# Altium schematic sheet RF_AFE.SchDoc: RFSoC_AMC
size 420 x 297 mm; Author: T. Przywozki; CompanyName: WUT ISE; DrawnBy: T. Przywozki; Organization: WUT ISE; Address1: PW ISE; Address2: Nowowiejska 15/19 00-665 Warsaw; Revision: 1.0; SheetNumber: 18; ModifiedBy: -; CheckedDate: -; Title2: 8 channel ADC & DAC; DivGrp: WUT ISE; Designer: T. Przywozki
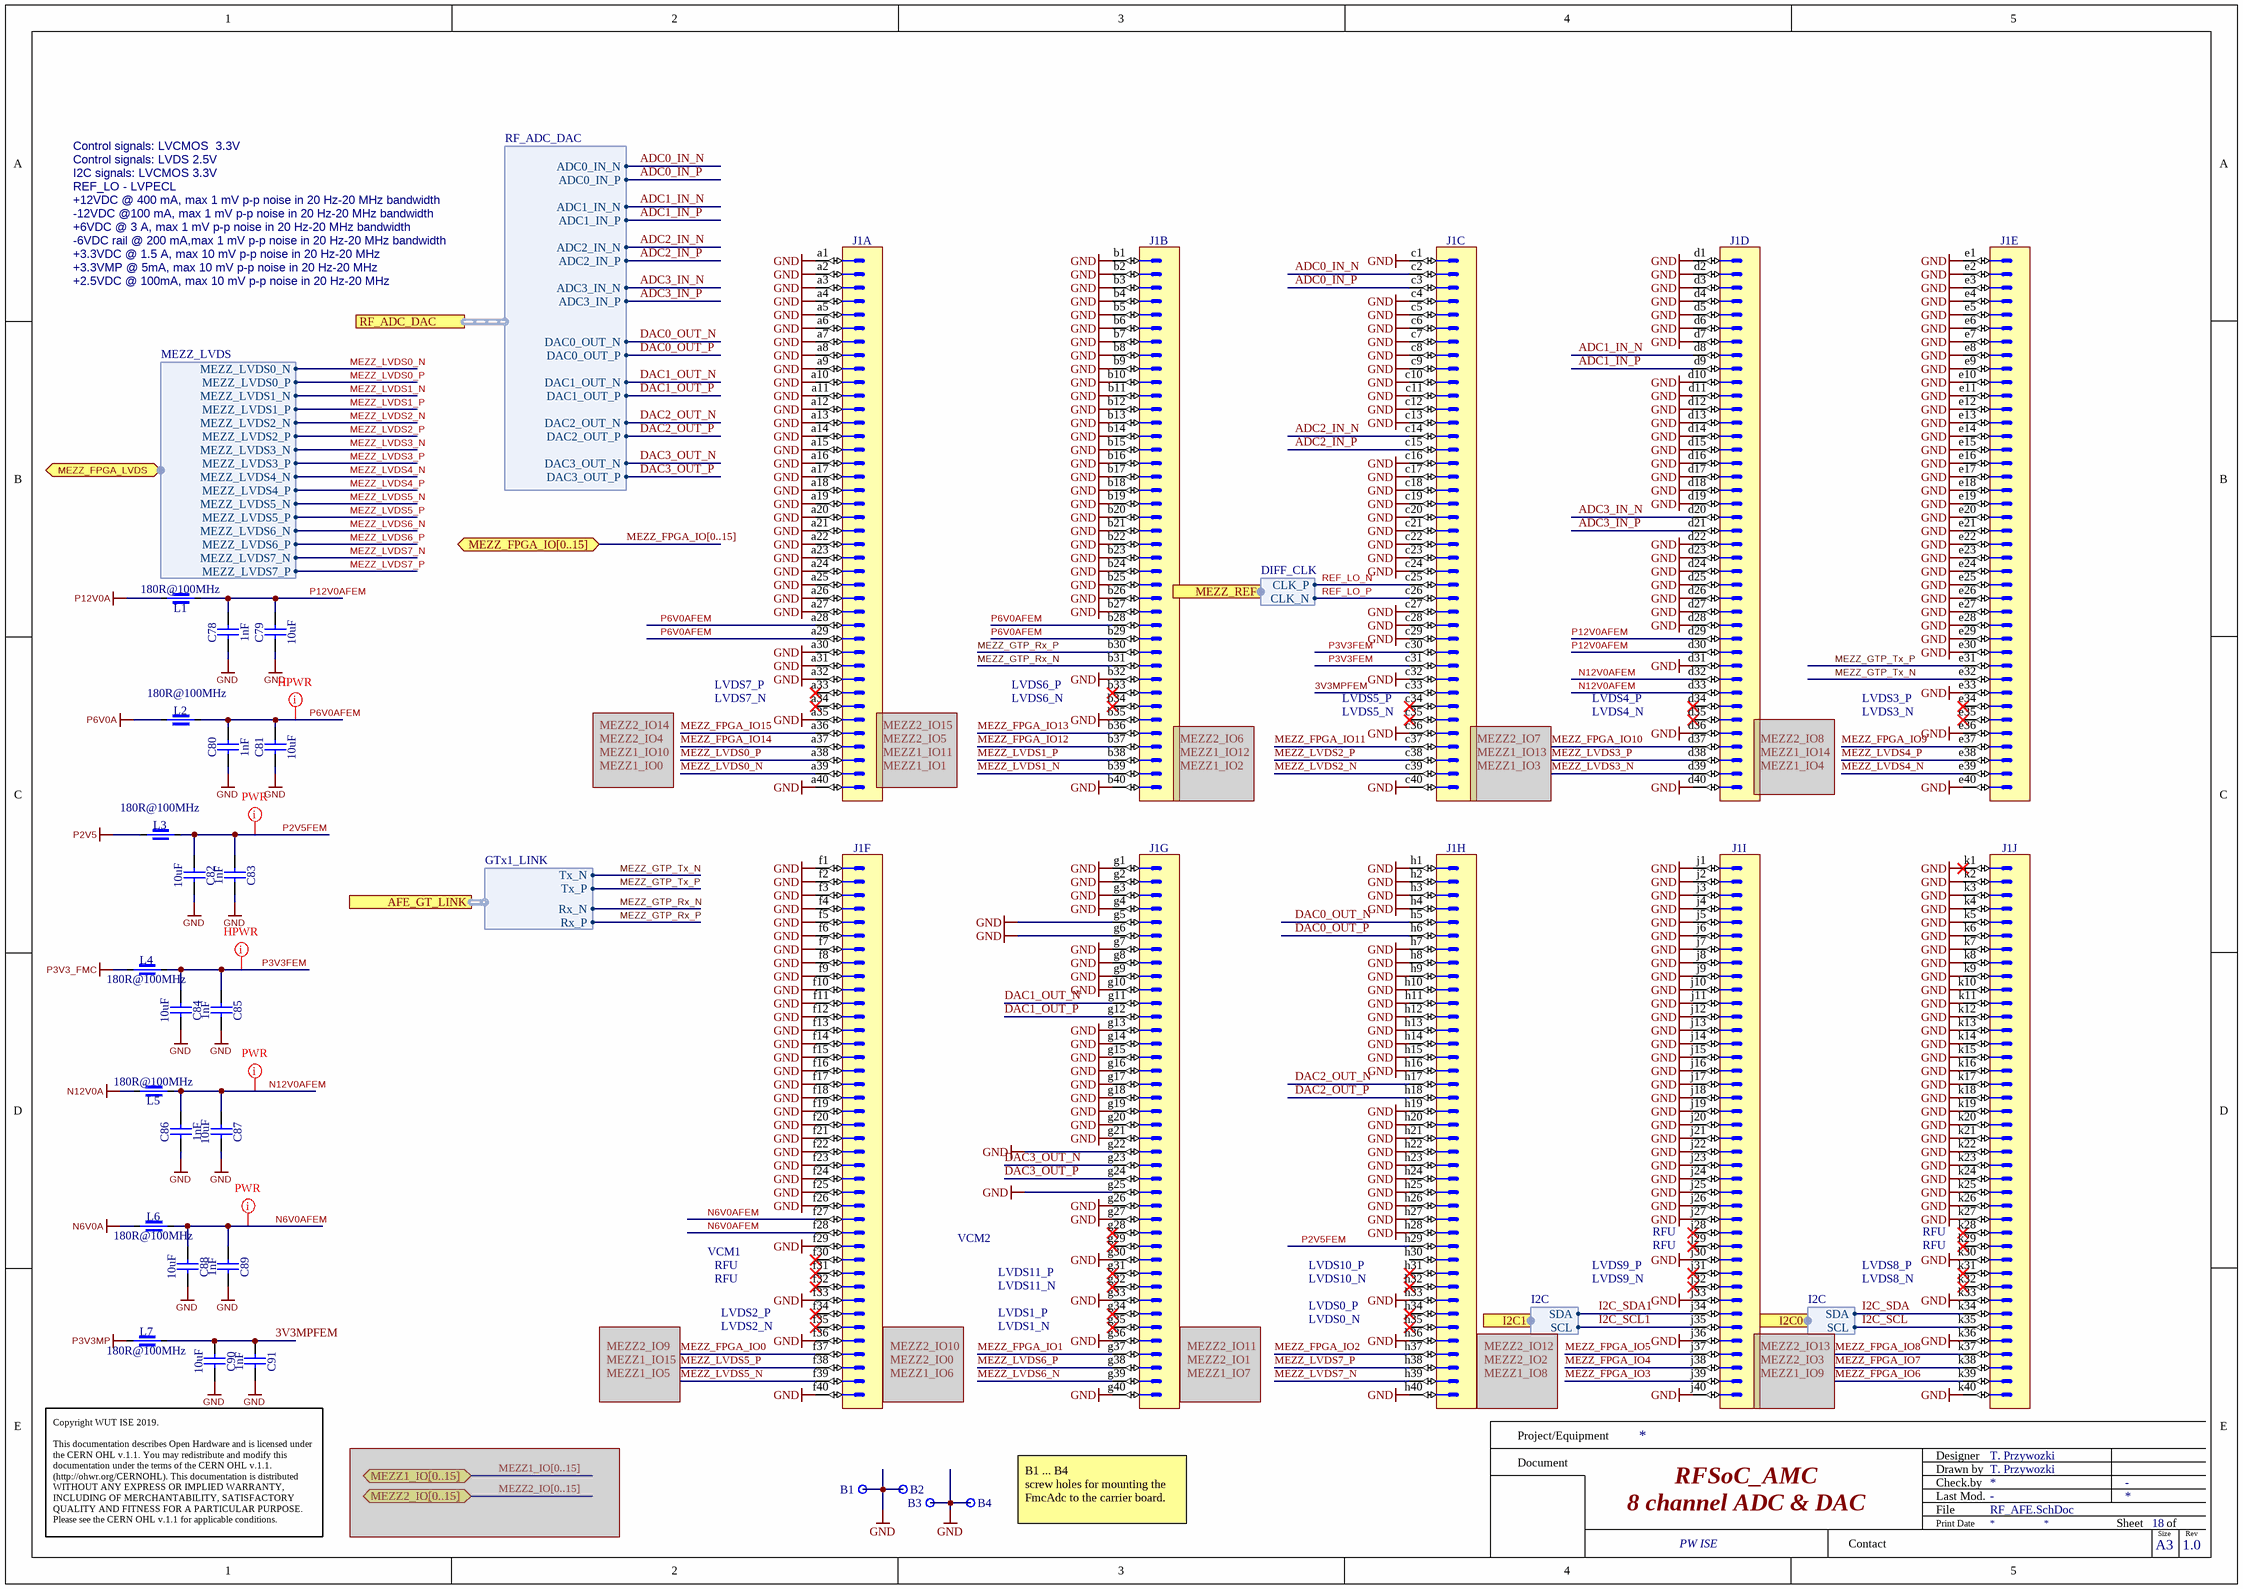
[diagram p0: RF_AFE.SchDoc]

## Parts
B1  Plated Hole  [MTG270_500]  (value not drawn)
B2  Plated Hole  [MTG270_500]  (value not drawn)
B3  Plated Hole  [MTG270_500]  (value not drawn)
B4  Plated Hole  [MTG270_500]  (value not drawn)
C78  1nF  [CAPC1608X90N]
C79  10uF  [CAPC3216X180N]
C80  1nF  [CAPC1608X90N]
C81  10uF  [CAPC3216X180N]
C82  10uF  [CAPC3216X180N]
C83  1nF  [CAPC1608X90N]
C84  10uF  [CAPC3216X180N]
C85  1nF  [CAPC1608X90N]
C86  1nF  [CAPC1608X90N]
C87  10uF  [CAPC3216X180N]
C88  10uF  [CAPC3216X180N]
C89  1nF  [CAPC1608X90N]
C90  10uF  [CAPC3216X180N]
C91  1nF  [CAPC1608X90N]
J1  VITA 57  [SAMTEC_ASP-134488-01]  (value not drawn)  (parts A,B,C,D,E,F,G,H,I,J of 10)
L1  180R@100MHz  [INDC4516X180N]
L2  180R@100MHz  [INDC4516X180N]
L3  180R@100MHz  [INDC4516X180N]
L4  180R@100MHz  [INDC4516X180N]
L5  180R@100MHz  [INDC4516X180N]
L6  180R@100MHz  [INDC4516X180N]
L7  180R@100MHz  [INDC4516X180N]

## Ports
AFE_GT_LINK (harness GTx1_LINK), I2C0 (harness I2C), I2C1 (harness I2C), MEZZ1_IO[0..15] (bidir), MEZZ2_IO[0..15] (bidir), MEZZ_FPGA_IO[0..15] (bidir), MEZZ_FPGA_LVDS (bidir, harness MEZZ_LVDS), MEZZ_REF (harness DIFF_CLK), RF_ADC_DAC (harness RF_ADC_DAC)

## Harnesses
RF_ADC_DAC: ADC0_IN_N, ADC0_IN_P, ADC1_IN_N, ADC1_IN_P, ADC2_IN_N, ADC2_IN_P, ADC3_IN_N, ADC3_IN_P, DAC0_OUT_N, DAC0_OUT_P, DAC1_OUT_N, DAC1_OUT_P, DAC2_OUT_N, DAC2_OUT_P, DAC3_OUT_N, DAC3_OUT_P
I2C: SCL, SDA
MEZZ_LVDS: MEZZ_LVDS0_N, MEZZ_LVDS0_P, MEZZ_LVDS1_N, MEZZ_LVDS1_P, MEZZ_LVDS2_N, MEZZ_LVDS2_P, MEZZ_LVDS3_N, MEZZ_LVDS3_P, MEZZ_LVDS4_N, MEZZ_LVDS4_P, MEZZ_LVDS5_N, MEZZ_LVDS5_P, MEZZ_LVDS6_N, MEZZ_LVDS6_P, MEZZ_LVDS7_N, MEZZ_LVDS7_P
GTx1_LINK: Rx_P, Rx_N, Tx_P, Tx_N
DIFF_CLK: CLK_P, CLK_N

## Nets
GND: B1.1 B2.1 B3.1 B4.1 C78.2 C79.2 C80.1 C81.1 C82.1 C83.1 C84.1 C85.1 C86.1 C87.2 C88.1 C89.1 C90.1 C91.1 J1.a1 J1.a2 J1.a3 J1.a4 J1.a5 J1.a6 J1.a7 J1.a8 J1.a9 J1.a10 J1.a11 J1.a12 J1.a13 J1.a14 J1.a15 J1.a16 J1.a17 J1.a18 J1.a19 J1.a20 J1.a21 J1.a22 J1.a23 J1.a24 J1.a25 J1.a26 J1.a27 J1.a30 J1.a31 J1.a32 J1.a35 J1.a40 J1.b1 J1.b2 J1.b3 J1.b4 J1.b5 J1.b6 J1.b7 J1.b8 J1.b9 J1.b10 J1.b11 J1.b12 J1.b13 J1.b14 J1.b15 J1.b16 J1.b17 J1.b18 J1.b19 J1.b20 J1.b21 J1.b22 J1.b23 J1.b24 J1.b25 J1.b26 J1.b27 J1.b32 J1.b35 J1.b40 J1.c1 J1.c4 J1.c5 J1.c6 J1.c7 J1.c8 J1.c9 J1.c10 J1.c11 J1.c12 J1.c13 J1.c16 J1.c17 J1.c18 J1.c19 J1.c20 J1.c21 J1.c22 J1.c23 J1.c24 J1.c27 J1.c28 J1.c29 J1.c32 J1.c36 J1.c40 J1.d1 J1.d2 J1.d3 J1.d4 J1.d5 J1.d6 J1.d7 J1.d10 J1.d11 J1.d12 J1.d13 J1.d14 J1.d15 J1.d16 J1.d17 J1.d18 J1.d19 J1.d22 J1.d23 J1.d24 J1.d25 J1.d26 J1.d27 J1.d28 J1.d31 J1.d36 J1.d40 J1.e1 J1.e2 J1.e3 J1.e4 J1.e5 J1.e6 J1.e7 J1.e8 J1.e9 J1.e10 J1.e11 J1.e12 J1.e13 J1.e14 J1.e15 J1.e16 J1.e17 J1.e18 J1.e19 J1.e20 J1.e21 J1.e22 J1.e23 J1.e24 J1.e25 J1.e26 J1.e27 J1.e28 J1.e29 J1.e30 J1.e33 J1.e36 J1.e40 J1.f1 J1.f2 J1.f3 J1.f4 J1.f5 J1.f6 J1.f7 J1.f8 J1.f9 J1.f10 J1.f11 J1.f12 J1.f13 J1.f14 J1.f15 J1.f16 J1.f17 J1.f18 J1.f19 J1.f20 J1.f21 J1.f22 J1.f23 J1.f24 J1.f25 J1.f26 J1.f29 J1.f33 J1.f36 J1.f40 J1.g1 J1.g2 J1.g3 J1.g4 J1.g5 J1.g6 J1.g7 J1.g8 J1.g9 J1.g10 J1.g13 J1.g14 J1.g15 J1.g16 J1.g17 J1.g18 J1.g19 J1.g20 J1.g21 J1.g22 J1.g25 J1.g26 J1.g27 J1.g30 J1.g33 J1.g36 J1.g40 J1.h1 J1.h2 J1.h3 J1.h4 J1.h7 J1.h8 J1.h9 J1.h10 J1.h11 J1.h12 J1.h13 J1.h14 J1.h15 J1.h16 J1.h19 J1.h20 J1.h21 J1.h22 J1.h23 J1.h24 J1.h25 J1.h26 J1.h27 J1.h28 J1.h33 J1.h36 J1.h40 J1.j1 J1.j2 J1.j3 J1.j4 J1.j5 J1.j6 J1.j7 J1.j8 J1.j9 J1.j10 J1.j11 J1.j12 J1.j13 J1.j14 J1.j15 J1.j16 J1.j17 J1.j18 J1.j19 J1.j20 J1.j21 J1.j22 J1.j23 J1.j24 J1.j25 J1.j26 J1.j27 J1.j30 J1.j33 J1.j36 J1.j40 J1.k1 J1.k2 J1.k3 J1.k4 J1.k5 J1.k6 J1.k7 J1.k8 J1.k9 J1.k10 J1.k11 J1.k12 J1.k13 J1.k14 J1.k15 J1.k16 J1.k17 J1.k18 J1.k19 J1.k20 J1.k21 J1.k22 J1.k23 J1.k24 J1.k25 J1.k26 J1.k27 J1.k30 J1.k33 J1.k36 J1.k40
N6V0A: L6.2
N12V0A: L5.2
P2V5: L3.2
P3V3_FMC: L4.2
P3V3MP: L7.2
P6V0A: L2.1
P12V0A: L1.1
3V3MPFEM: C90.2 C91.2 J1.c33 L7.1
ADC0_IN_N: J1.c2 ; port RF_ADC_DAC.ADC0_IN_N
ADC0_IN_P: J1.c3 ; port RF_ADC_DAC.ADC0_IN_P
ADC1_IN_N: J1.d8 ; port RF_ADC_DAC.ADC1_IN_N
ADC1_IN_P: J1.d9 ; port RF_ADC_DAC.ADC1_IN_P
ADC2_IN_N: J1.c14 ; port RF_ADC_DAC.ADC2_IN_N
ADC2_IN_P: J1.c15 ; port RF_ADC_DAC.ADC2_IN_P
ADC3_IN_N: J1.d20 ; port RF_ADC_DAC.ADC3_IN_N
ADC3_IN_P: J1.d21 ; port RF_ADC_DAC.ADC3_IN_P
DAC0_OUT_N: J1.h5 ; port RF_ADC_DAC.DAC0_OUT_N
DAC0_OUT_P: J1.h6 ; port RF_ADC_DAC.DAC0_OUT_P
DAC1_OUT_N: J1.g11 ; port RF_ADC_DAC.DAC1_OUT_N
DAC1_OUT_P: J1.g12 ; port RF_ADC_DAC.DAC1_OUT_P
DAC2_OUT_N: J1.h17 ; port RF_ADC_DAC.DAC2_OUT_N
DAC2_OUT_P: J1.h18 ; port RF_ADC_DAC.DAC2_OUT_P
DAC3_OUT_N: J1.g23 ; port RF_ADC_DAC.DAC3_OUT_N
DAC3_OUT_P: J1.g24 ; port RF_ADC_DAC.DAC3_OUT_P
I2C_SCL: J1.k35 ; port I2C0.SCL
I2C_SCL1: J1.j35 ; port I2C1.SCL
I2C_SDA: J1.k34 ; port I2C0.SDA
I2C_SDA1: J1.j34 ; port I2C1.SDA
MEZZ_FPGA_IO1: J1.g37
MEZZ_FPGA_IO2: J1.h37
MEZZ_FPGA_IO3: J1.j39
MEZZ_FPGA_IO4: J1.j38
MEZZ_FPGA_IO5: J1.j37
MEZZ_FPGA_IO9: J1.e37
MEZZ_FPGA_IO11: J1.c37
MEZZ_FPGA_IO12: J1.b37
MEZZ_FPGA_IO13: J1.b36
MEZZ_FPGA_IO14: J1.a37
MEZZ_FPGA_IO15: J1.a36
MEZZ_GTP_Rx_N: J1.b31 ; port AFE_GT_LINK.Rx_N
MEZZ_GTP_Rx_P: J1.b30 ; port AFE_GT_LINK.Rx_P
MEZZ_GTP_Tx_N: J1.e32 ; port AFE_GT_LINK.Tx_N
MEZZ_GTP_Tx_P: J1.e31 ; port AFE_GT_LINK.Tx_P
MEZZ_LVDS0_N: J1.a39 ; port MEZZ_FPGA_LVDS.MEZZ_LVDS0_N
MEZZ_LVDS0_P: J1.a38 ; port MEZZ_FPGA_LVDS.MEZZ_LVDS0_P
MEZZ_LVDS1_N: J1.b39 ; port MEZZ_FPGA_LVDS.MEZZ_LVDS1_N
MEZZ_LVDS1_P: J1.b38 ; port MEZZ_FPGA_LVDS.MEZZ_LVDS1_P
MEZZ_LVDS2_N: J1.c39 ; port MEZZ_FPGA_LVDS.MEZZ_LVDS2_N
MEZZ_LVDS2_P: J1.c38 ; port MEZZ_FPGA_LVDS.MEZZ_LVDS2_P
MEZZ_LVDS3_N: port MEZZ_FPGA_LVDS.MEZZ_LVDS3_N
MEZZ_LVDS3_P: port MEZZ_FPGA_LVDS.MEZZ_LVDS3_P
MEZZ_LVDS4_N: J1.e39 ; port MEZZ_FPGA_LVDS.MEZZ_LVDS4_N
MEZZ_LVDS4_P: J1.e38 ; port MEZZ_FPGA_LVDS.MEZZ_LVDS4_P
MEZZ_LVDS5_N: port MEZZ_FPGA_LVDS.MEZZ_LVDS5_N
MEZZ_LVDS5_P: port MEZZ_FPGA_LVDS.MEZZ_LVDS5_P
MEZZ_LVDS6_N: J1.g39 ; port MEZZ_FPGA_LVDS.MEZZ_LVDS6_N
MEZZ_LVDS6_P: J1.g38 ; port MEZZ_FPGA_LVDS.MEZZ_LVDS6_P
MEZZ_LVDS7_N: J1.h39 ; port MEZZ_FPGA_LVDS.MEZZ_LVDS7_N
MEZZ_LVDS7_P: J1.h38 ; port MEZZ_FPGA_LVDS.MEZZ_LVDS7_P
N6V0AFEM: C88.2 C89.2 J1.f27 J1.f28 L6.1
N12V0AFEM: C86.2 C87.1 J1.d32 J1.d33 L5.1
P2V5FEM: C82.2 C83.2 J1.h29 L3.1
P3V3FEM: C84.2 C85.2 J1.c30 J1.c31 L4.1
P6V0AFEM: C80.2 C81.2 J1.a28 J1.a29 J1.b28 J1.b29 L2.2
P12V0AFEM: C78.1 C79.1 J1.d29 J1.d30 L1.2
REF_LO_N: J1.c25 ; port MEZZ_REF.CLK_P
REF_LO_P: J1.c26 ; port MEZZ_REF.CLK_N

Not connected (* = marked no-connect by the designer): J1 a33* a34* b33* b34* c34* c35* d34* d35* d37 d38 d39 e34* e35* f30* f31* f32* f34* f35* f37 f38 f39 g28* g29* g31* g32* g34* g35* h30 h31* h32* h34* h35* j28* j29* j31* j32* k28* k29* k31* k32* k37 k38 k39

## Buses and harness runs
bus MEZZ_FPGA_IO[0..15] = port MEZZ_FPGA_IO[0..15]

## Layout directives
net class HPWR: P3V3FEM, P6V0AFEM
net class PWR: N6V0AFEM, N12V0AFEM, P2V5FEM

## Notes on the sheet
- I2C signals: LVCMOS 3.3V
- REF_LO - LVPECL
- Control signals: LVCMOS  3.3V
- Control signals: LVDS 2.5V
- +6VDC @ 3 A, max 1 mV p-p noise in 20 Hz-20 MHz bandwidth
- +3.3VMP @ 5mA, max 10 mV p-p noise in 20 Hz-20 MHz
- -12VDC @100 mA, max 1 mV p-p noise in 20 Hz-20 MHz bandwidth
- +3.3VDC @ 1.5 A, max 10 mV p-p noise in 20 Hz-20 MHz
- -6VDC rail @ 200 mA,max 1 mV p-p noise in 20 Hz-20 MHz bandwidth
- +12VDC @ 400 mA, max 1 mV p-p noise in 20 Hz-20 MHz bandwidth
- +2.5VDC @ 100mA, max 10 mV p-p noise in 20 Hz-20 MHz
- LVDS7_P
- LVDS7_N
- LVDS6_P
- LVDS6_N
- (near J1) LVDS5_P
- (near J1) LVDS5_N
- LVDS4_P
- LVDS4_N
- LVDS3_P
- LVDS3_N
- VCM1
- RFU
- VCM2
- LVDS10_P
- LVDS9_P
- (near J1) RFU
- LVDS8_P
- LVDS2_P
- LVDS2_N
- LVDS1_P
- LVDS1_N
- LVDS11_P
- LVDS11_N
- LVDS0_P
- LVDS0_N
- LVDS10_N
- LVDS9_N
- LVDS8_N
- B1 ... B4
  screw holes for mounting the FmcAdc to the carrier board.
- Project/Equipment
- Document
- Designer
- Drawn by
- Check.by
- Copyright WUT ISE 2019.
  This documentation describes Open Hardware and is licensed under the CERN OHL v.1.1. You may redistribute and modify this documentation under the terms of the CERN OHL v.1.1. (http://ohwr.org/CERNOHL). This documentation is distributed WITHOUT ANY EXPRESS OR IMPLIED WARRANTY, INCLUDING OF MERCHANTABILITY, SATISFACTORY QUALITY AND FITNESS FOR A PARTICULAR PURPOSE. Please see the CERN OHL v.1.1 for applicable conditions.
- Contact
- File
- Last Mod.
- Print Date
- Sheet
- Size
- A3
- of
- Rev

## Library data of the parts
B1-B4 = PLATED_HOLE2.7_PAD5.0: Single Terminal Socket; Part Description: Plated Through Hole: Hole Dia.=2.7mm Pad Dia.=5.0mm; Mounted: No; Part Number: PLATED_HOLE2.7_PAD5.0; Component Kind: Standard (No BOM); Component Type: Standard (No BOM); Pin Count: 1; Family: Plated Hole; Socket: No; SMD: No; Sense: No; Status: None; ComponentHeight: 0mm; HelpURL: Undefined; Author: CERN DEM JMW; CreateDate: 27.09.2011; LatestRevisionDate: 27.09.2011; PackageDescription: Plated Through Hole: Hole Dia.=2.7mm Pad Dia.=5.0mm
C78 C80 C83 C85 C86 C89 C91 = CC0603_1NF_50V_5%_NP0: Non-polarised capacitor; Manufacturer: GENERIC; Manufacturer1 Part Number: CC0603JRNPO9BN102; Part Description: SMD Multilayer Chip Ceramic Capacitor; TC: C0G/NP0; Tolerance: ±5%; Voltage: 50V; Case: 0603; Manufacturer Part Number: CC0603_1NF_50V_5%_NP0; Manufacturer1 Example: YAGEO PHYCOMP; Part Number: CC0603_1NF_50V_5%_NP0; Pin Count: 2; SMD: Yes; Status: Preferred; Value: 1nF; Component Kind: Standard; Component Type: Standard; Mounted: Yes; Socket: No; Sense: No; Manufacturer1 ComponentHeight: 0.9mm; HelpURL: \\cern.ch\dfs\Applications\Altium\Datasheets\CC0805_NP0_PHYCOMP_16VTO50V.pdf; Author: CERN DEM JLC; CreateDate: 22.10.2012; LatestRevisionDate: 22.10.2012
C79 C81 C82 C84 C87 C88 C90 = CC1206_10uF_25V_10%_X7R: Non-polarised capacitor; Manufacturer: GENERIC; Manufacturer1 Part Number: C1206C106K4RACTU; Part Description: SMD Multilayer Chip Ceramic Capacitor; TC: X7R; Tolerance: ±10%; Voltage: 25V; Case: 1206; Manufacturer Part Number: CC1206_10uF_25V_10%_X7R; Manufacturer1 Example: KEMET; Part Number: CC1206_10UF_25V_10%_X7R; Pin Count: 2; SMD: Yes; Status: Preferred; Value: 10uF; Component Kind: Standard; Component Type: Standard; Mounted: Yes; Socket: No; Sense: No; Manufacturer1 ComponentHeight: 1.8mm; HelpURL: \\cern.ch\dfs\Applications\Altium\Datasheets\CC1206_X7R_KEMET.pdf; Author: CERN DEM JLC; CreateDate: 12.09.2012; LatestRevisionDate: 12.09.2012
J1 = SAMTEC_ASP-134488-01: Connector VITA 57, 400 Male contacts in 10 row abcdefghj; Part Description: 400 contacts (10 rows abcdefghj) Surface Mount Male Connector, VITA 57 (MC-HPC-10); Manufacturer: SAMTEC; Part Number: SAMTEC_ASP-134488-01; Component Kind: Standard; Component Type: Standard; Pin Count: 400; Family: VITA 57; Mounted: Yes; Socket: No; SMD: Yes; Status: None; Manufacturer Part Number: ASP-134488-01; ComponentHeight: 6.1mm; HelpURL: \\cern.ch\dfs\Applications\Altium\Datasheets\SAMTEC_ASP-134488-01.pdf; Author: CERN DEM JLC; CreateDate: 30/04/2009; LatestRevisionDate: 17/08/2009; Table: SAMTEC
L1-L7 = IND1806_MURATA_BLM41PG181SN1L: Manufacturer: MURATA; Part Description: SMD EMI Suppression Chip Ferrite Bead (BLM41P Series); Power: 3.5A; Resistance: 0.02R; Case: 1806; ComponentHeight: 1.8mm; Manufacturer Part Number: BLM41PG181SN1L; Part Number: IND1806_MURATA_BLM41PG181SN1L; Pin Count: 2; SMD: Yes; Value: 180R@100MHz; Component Kind: Standard; Component Type: Standard; Status: None; Mounted: Yes; Socket: No; Sense: No; HelpURL: \\cern.ch\dfs\Applications\Altium\Datasheets\IND1806_MURATA_BLM41P.pdf; Author: CERN DEM JLC; CreateDate: 26.06.2012; LatestRevisionDate: 26.06.2012